# Altium schematic sheet SheetArduinoESP32.SchDoc
size A4
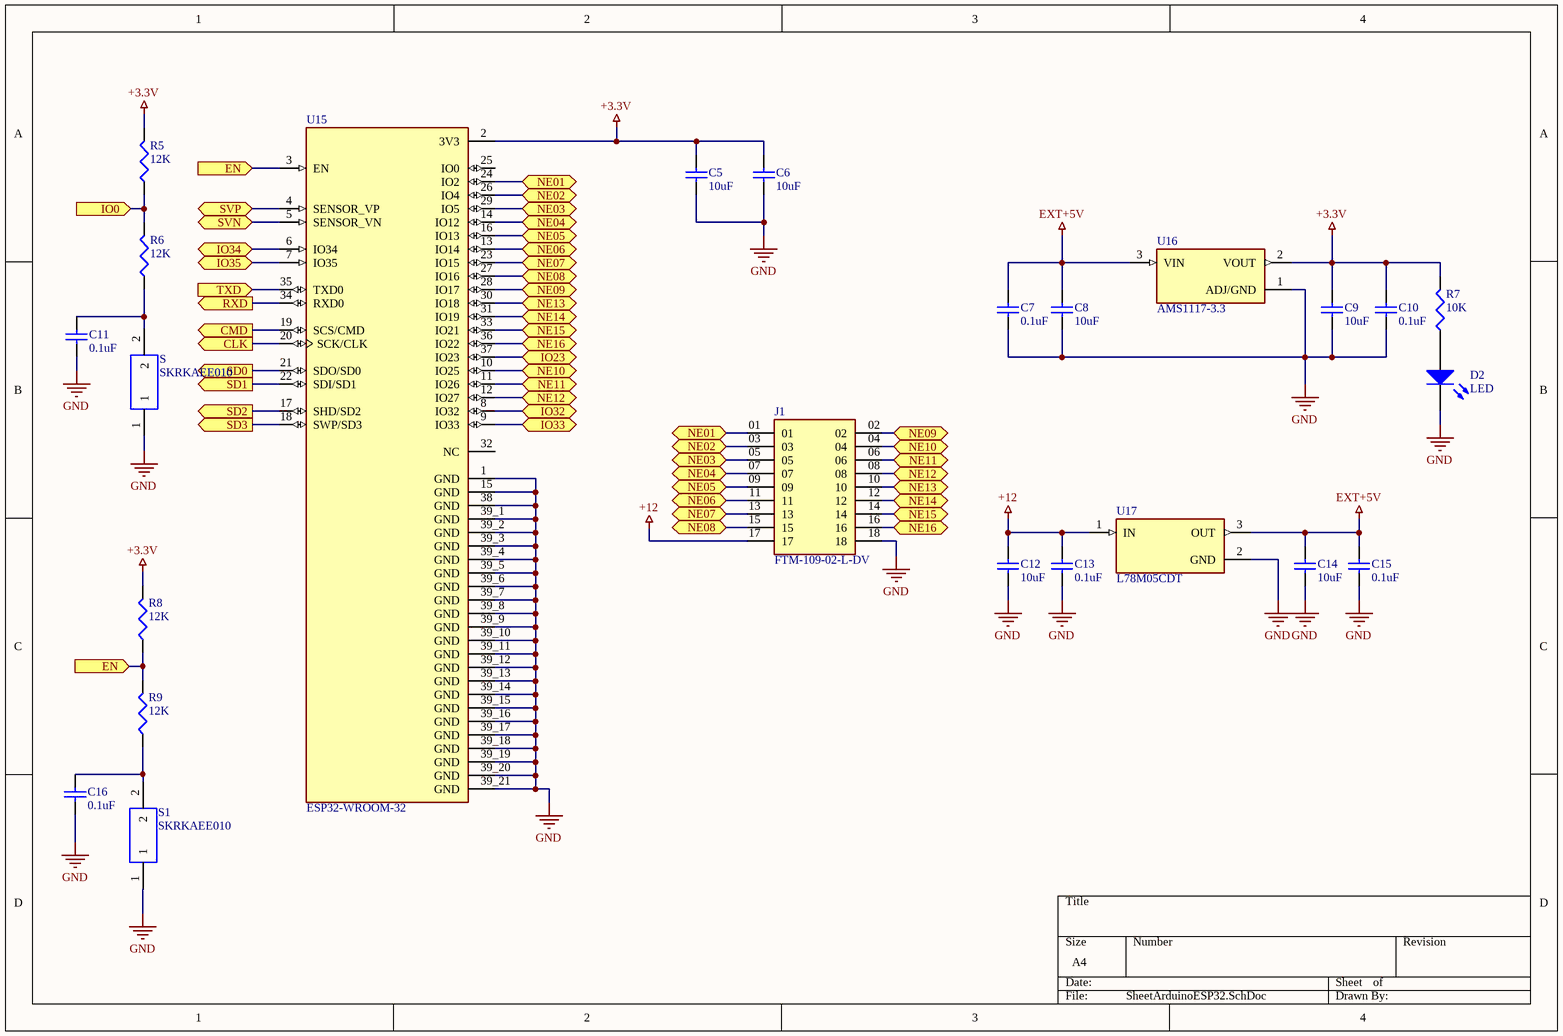
[diagram p0: SheetArduinoESP32.SchDoc]

## Parts
C5  10uF  [C1206]
C6  10uF  [C1206]
C7  0.1uF  [1608[0603]]
C8  10uF  [C1206]
C9  10uF  [C1206]
C10  0.1uF  [1608[0603]]
C11  0.1uF  [1608[0603]]
C12  10uF  [C1206]
C13  0.1uF  [1608[0603]]
C14  10uF  [C1206]
C15  0.1uF  [1608[0603]]
C16  0.1uF  [1608[0603]]
D2  LED  [3.5X2.8X1.9]
J1  FTM-109-02-L-DV  [SAMTEC_FTM-109-02-L-DV]
R5  12K  [J1-0603]
R6  12K  [J1-0603]
R7  10K  [J1-0603]
R8  12K  [J1-0603]
R9  12K  [J1-0603]
S  SKRKAEE010  [SKRK]
S1  SKRKAEE010  [SKRK]
U15  ESP32-WROOM-32  [MODULE_ESP32-WROOM-32]
U16  AMS1117-3.3  [SOT229P700X180-4N]
U17  L78M05CDT  [VREG_L78M05CDT]

## Ports
CLK (out), CMD (out), EN (in), IO0 (in), IO23 (bidir), IO32 (bidir), IO33 (bidir), IO34 (bidir), IO35 (bidir), NE01 (bidir), NE02 (bidir), NE03 (bidir), NE04 (bidir), NE05 (bidir), NE06 (bidir), NE07 (bidir), NE08 (bidir), NE09 (bidir), NE10 (bidir), NE11 (bidir), NE12 (bidir), NE13 (bidir), NE14 (bidir), NE15 (bidir), NE16 (bidir), RXD (out), SD0 (out), SD1 (out), SD2 (out), SD3 (out), SVN (bidir), SVP (bidir), TXD (in)

## Nets
+3.3V: C5.2 C6.2 C9.2 C10.2 R5.2 R7.2 R8.2 U15.2(3V3) U16.2(VOUT)
+12: C12.2 C13.2 J1.17 U17.1(IN)
EXT+5V: C7.2 C8.2 C14.2 C15.2 U16.3(VIN) U17.3(OUT)
GND: C5.1 C6.1 C7.1 C8.1 C9.1 C10.1 C11.1 C12.1 C13.1 C14.1 C15.1 C16.1 D2.2(K) J1.18 S.1 S1.1 U15.1(GND) U15.15(GND) U15.38(GND) U15.39_1(GND) U15.39_2(GND) U15.39_3(GND) U15.39_4(GND) U15.39_5(GND) U15.39_6(GND) U15.39_7(GND) U15.39_8(GND) U15.39_9(GND) U15.39_10(GND) U15.39_11(GND) U15.39_12(GND) U15.39_13(GND) U15.39_14(GND) U15.39_15(GND) U15.39_16(GND) U15.39_17(GND) U15.39_18(GND) U15.39_19(GND) U15.39_20(GND) U15.39_21(GND) U16.1(ADJ/GND) U17.2(GND)
CLK: U15.20(SCK/CLK) ; port CLK
CMD: U15.19(SCS/CMD) ; port CMD
EN: R8.1 R9.2 U15.3(EN) ; port EN
IO0: R5.1 R6.2 ; port IO0
IO23: U15.37(IO23) ; port IO23
IO32: U15.8(IO32) ; port IO32
IO33: U15.9(IO33) ; port IO33
IO34: U15.6(IO34) ; port IO34
IO35: U15.7(IO35) ; port IO35
NE01: J1.01 U15.24(IO2) ; port NE01
NE02: J1.03 U15.26(IO4) ; port NE02
NE03: J1.05 U15.29(IO5) ; port NE03
NE04: J1.07 U15.14(IO12) ; port NE04
NE05: J1.09 U15.16(IO13) ; port NE05
NE06: J1.11 U15.13(IO14) ; port NE06
NE07: J1.13 U15.23(IO15) ; port NE07
NE08: J1.15 U15.27(IO16) ; port NE08
NE09: J1.02 U15.28(IO17) ; port NE09
NE10: J1.04 U15.10(IO25) ; port NE10
NE11: J1.06 U15.11(IO26) ; port NE11
NE12: J1.08 U15.12(IO27) ; port NE12
NE13: J1.10 U15.30(IO18) ; port NE13
NE14: J1.12 U15.31(IO19) ; port NE14
NE15: J1.14 U15.33(IO21) ; port NE15
NE16: J1.16 U15.36(IO22) ; port NE16
RXD: U15.34(RXD0) ; port RXD
SD0: U15.21(SDO/SD0) ; port SD0
SD1: U15.22(SDI/SD1) ; port SD1
SD2: U15.17(SHD/SD2) ; port SD2
SD3: U15.18(SWP/SD3) ; port SD3
SVN: U15.5(SENSOR_VN) ; port SVN
SVP: U15.4(SENSOR_VP) ; port SVP
TXD: U15.35(TXD0) ; port TXD
NetC11_2: C11.2 R6.1 S.2
NetC16_2: C16.2 R9.1 S1.2
NetD2_1: D2.1(A) R7.1

Not connected (* = marked no-connect by the designer): U15 25(IO0) 32(NC)

## Library data of the parts
C5-C16 = Cap Semi: Capacitor (Semiconductor SIM Model); Published: 8-Jun-2000; LatestRevisionDate: 29-May-2009; LatestRevisionNote: IPC-7351 Footprint Added.; PackageReference: C1206; Publisher: Altium Limited; PackageDescription: Chip Capacitor
D2 = LED3: Typical BLUE SiC LED; Published: 8-Jun-2000; LatestRevisionDate: 17-Dec-2003; LatestRevisionNote: PCB Footprint replaced.; DatasheetVersion: 16-Apr-2002; PackageVersion: 16-Apr-2002; PackageReference: 3.5X2.8X1.9; Publisher: Altium Limited; PackageDescription: SM LED; 2 C-Bend Leads; Body 3.5 x 2.8 x 1.9 mm, inc leads (LxWxH typ)
R5-R9 = Res3: Resistor; Published: 8-Jun-2000; LatestRevisionDate: 29-May-2009; LatestRevisionNote: IPC-7351 Footprint Added.; PackageReference: J1-0603; Publisher: Altium Limited; PackageDescription: Chip Resistor
S S1 = SKRKAEE010: Switch Tactile N.O. SPST Round Button Gull Wing 0.05A 12VDC 1.57N SMD T/R; MF: ALPS; Availability: Unavailable; Price: None; Package: None; Value: *; SnapEDA_Link: https://www.snapeda.com/parts/SKRKAEE010/ALPS/view-part/380772/?ref=snap; MP: SKRKAEE010
U15 = ESP32-WROOM-32: Bluetooth, WiFi 802.11b/g/n, Bluetooth v4.2 +EDR, Class 1, 2 and 3 Transceiver Module 2.4GHz ~ 2.5GHz Antenna Not Included, U.FL Surface Mount; MF: Espressif Systems; MP: ESP32-WROOM-32; Purchase-URL: https://pricing.snapeda.com/search/part/ESP32-WROOM-32/?ref=eda; Package: Module Espressif Systems; Value: *; Digi-Key_Part_Number: 1965-ESP32-WROOM-32U-N4CT-ND; Check_prices: https://www.snapeda.com/parts/ESP32-WROOM-32/Espressif+Systems/view-part/?ref=eda; SnapEDA_Link: https://www.snapeda.com/parts/ESP32-WROOM-32/Espressif+Systems/view-part/?ref=snap
U16 = AMS1117-3.3: Sot223/Pkg 1-Amp 3.3-Volt Low Drop Out Voltage Regulatator; MF: Advanced Monolithic Systems; Price: None; Package: None; Value: *; MP: AMS1117-3.3; Availability: Unavailable; SnapEDA_Link: https://www.snapeda.com/parts/AMS1117-3.3/Advanced%20Monolithic%20Systems/view-part/53450/?ref=snap
U17 = L78M05CDT: 7805 based precision 5V fixed regulator with output current of up to 500mA and wide temperature operating range of 0Â°C to 150Â°C.; MF: STMicroelectronics; Package: TO-252-3 STMicroelectronics; MP: L78M05CDT; Value: *; Availability: In Stock; SnapEDA_Link: https://www.snapeda.com/parts/L78M05CDT/STMicroelectronics/view-part/?ref=snap; Price: None; Check_prices: https://www.snapeda.com/parts/L78M05CDT/STMicroelectronics/view-part/?ref=eda
J1 = FTM-109-02-L-DV: Package: None; Price: None; Value: *; MP: FTM-109-02-L-DV; Availability: Unavailable